# EAGLE design schematic (EAGLE 8.0.0)
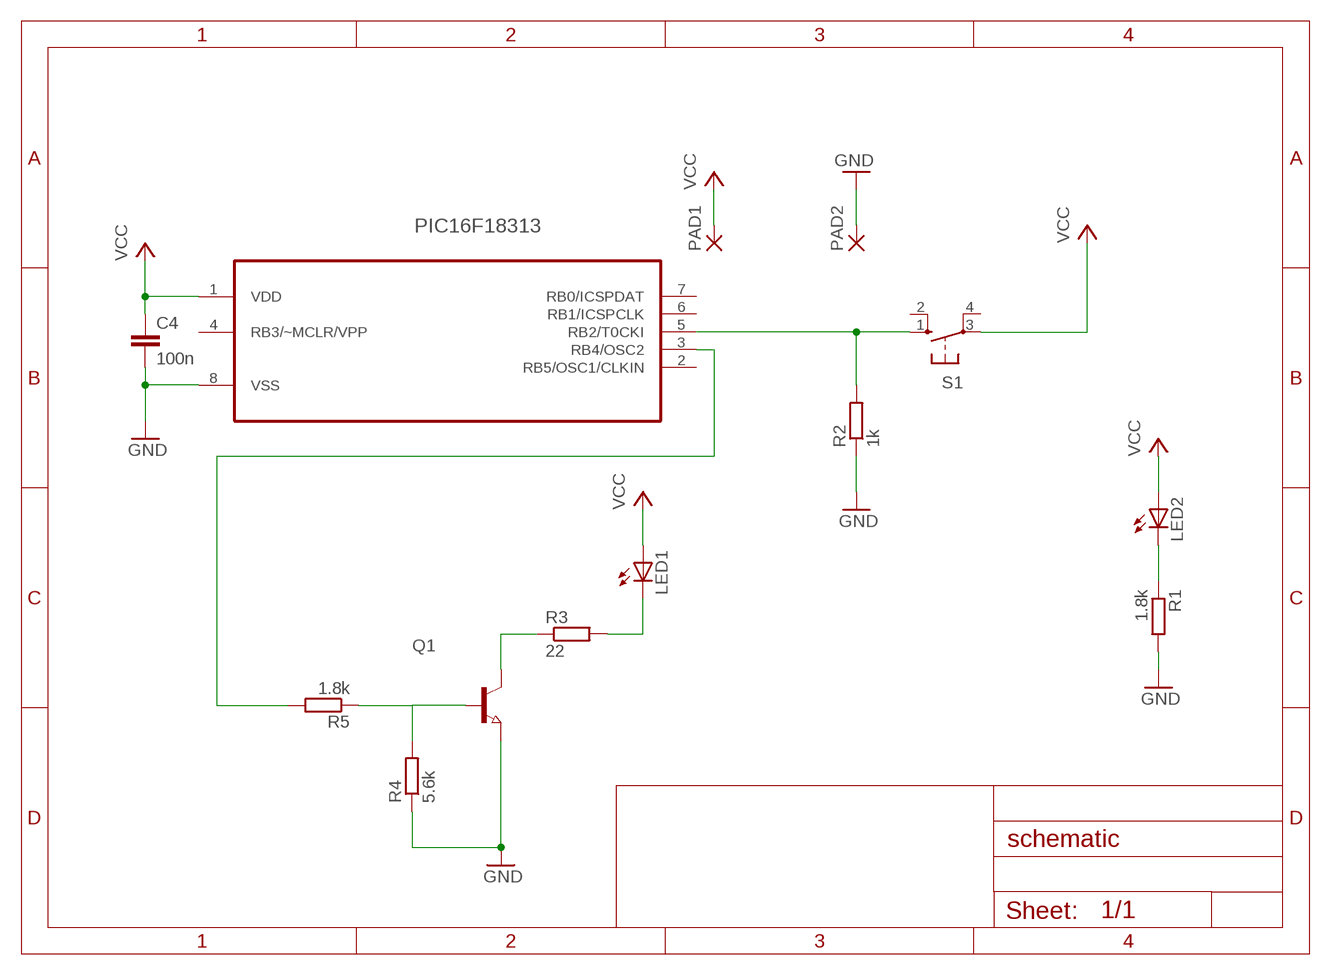
[diagram p0: schematic, sheet 1]

## Parts
C4  100n  C-EUC1206  [C1206]
LED1  LED3MM  [LED3MM]
LED2  LEDCHIPLED_1206  [CHIPLED_1206]
PAD1  2,54/0,9  [2,54/0,9]
PAD2  2,54/0,9  [2,54/0,9]
PIC16F18313  PIC12F519-I/P  [DIP254P762X533-8]
Q1  NPN-TRANSISTOR_SOT23  [SOT23]
R1  1.8k  R-EU_M1206  [M1206]
R2  1k  R-EU_M1206  [M1206]
R3  22  R-EU_M1206  [M1206]
R4  5.6k  R-EU_M1206  [M1206]
R5  1.8k  R-EU_M1206  [M1206]
S1  10-XX  [B3F-10XX]

## Nets
GND: C4.2 PAD2.1(P) PIC16F18313.8(VSS) Q1.2(E) R1.2 R2.1 R4.1
N$1: PIC16F18313.3(RB4/OSC2) R5.2
N$2: PIC16F18313.5(RB2/T0CKI) R2.2 S1.1(S)
N$3: Q1.3(C) R3.1
N$4: LED1.K(C) R3.2
N$5: LED2.C R1.1
N$6: Q1.1(B) R4.2 R5.1
VCC: C4.1 LED1.A LED2.A PAD1.1(P) PIC16F18313.1(VDD) S1.3(P)
Unconnected: PIC16F18313.2(RB5/OSC1/CLKIN) PIC16F18313.4(RB3/~MCLR/VPP) PIC16F18313.6(RB1/ICSPCLK) PIC16F18313.7(RB0/ICSPDAT) S1.2(S1) S1.4(P1)

## Library data of the parts
C4 = resistor:C-EU: CAPACITOR, European symbol
LED1 LED2 = led:LED: LED OSRAM: - CHIPLED LG R971, LG N971, LY N971, LG Q971, LY Q971, LO R971, LY R971 LH N974, LH R974 LS Q976, LO Q976, LY Q976 LO Q996 - Hyper CHIPLED LW Q18S LB Q993, LB Q99A, LB R99A - SideLED LS A670, LO A670, LY A670, LG A670, LP A670 LB A673, LV A673, LT A673, LW A673 LH A674 LY A675 LS A676, LA A676, LO A676, LY A676, LW A676 LS A679, LY A679, LG A679 - Hyper Micro SIDELED® LS Y876, LA Y876, LO Y876, LY Y876 LT Y87S - SmartLED LW L88C, LW L88S LB L89C, LB L89S, LG L890 LS L89K, LO L89K, LY L89K LS L896, LA L896, LO L896, LY L896 - TOPLED LS T670, LO T670, LY T670, LG T670, LP T670 LSG T670, LSP T670, LSY T670, LOP T670, LYG T670 LG T671, LOG T671, LSG T671 LB T673, LV T673, LT T673, LW T673 LH T674 LS T676, LA T676, LO T676, LY T676, LB T676, LH T676, LSB T676, LW T676 LB T67C, LV T67C, LT T67C, LS T67K, LO T67K, LY T67K, LW E67C LS E67B, LA E67B, LO E67B, LY E67B, LB E67C, LV E67C, LT E67C LW T67C LS T679, LY T679, LG T679 LS T770, LO T770, LY T770, LG T770, LP T770 LB T773, LV T773, LT T773, LW T773 LH T774 LS E675, LA E675, LY E675, LS T675 LS T776, LA T776, LO T776, LY T776, LB T776 LHGB T686 LT T68C, LB T68C - Hyper Mini TOPLED® LB M676 - Mini TOPLED Santana® LG M470 LS M47K, LO M47K, LY M47K Source: http://www.osram.convergy.de LUXEON: - LUMILED® LXK2-PW12-R00, LXK2-PW12-S00, LXK2-PW14-U00, LXK2-PW14-V00 LXK2-PM12-R00, LXK2-PM12-S00, LXK2-PM14-U00 LXK2-PE12-Q00, LXK2-PE12-R00, LXK2-PE12-S00, LXK2-PE14-T00, LXK2-PE14-U00 LXK2-PB12-K00, LXK2-PB12-L00, LXK2-PB12-M00, LXK2-PB14-N00, LXK2-PB14-P00, LXK2-PB14-Q00 LXK2-PR12-L00, LXK2-PR12-M00, LXK2-PR14-Q00, LXK2-PR14-R00 LXK2-PD12-Q00, LXK2-PD12-R00, LXK2-PD12-S00 LXK2-PH12-R00, LXK2-PH12-S00 LXK2-PL12-P00, LXK2-PL12-Q00, LXK2-PL12-R00 Source: www.luxeon.com KINGBRIGHT: KA-3528ASYC Source: www.kingbright.com
PAD1 PAD2 = wirepad:2,54/0,9: THROUGH-HOLE PAD
PIC16F18313 = Microchip_By_element14_Batch_1:PIC12F519-I/P: 8-Bit Flash Microcontrollers; MPN: PIC18F18313-I/P; OC_FARNELL: 1548437; OC_NEWARK: 40M1387; PACKAGE: DIP-8; SUPPLIER: Microchip
Q1 = semicon-smd-ipc:NPN-TRANSISTOR_: NPN TRANSISTOR
R1-R5 = resistor:R-EU_: RESISTOR, European symbol
S1 = switch-omron:10-XX: OMRON SWITCH; MPN: B3F-1000; OC_FARNELL: 176432; OC_NEWARK: 36M3542

## Board
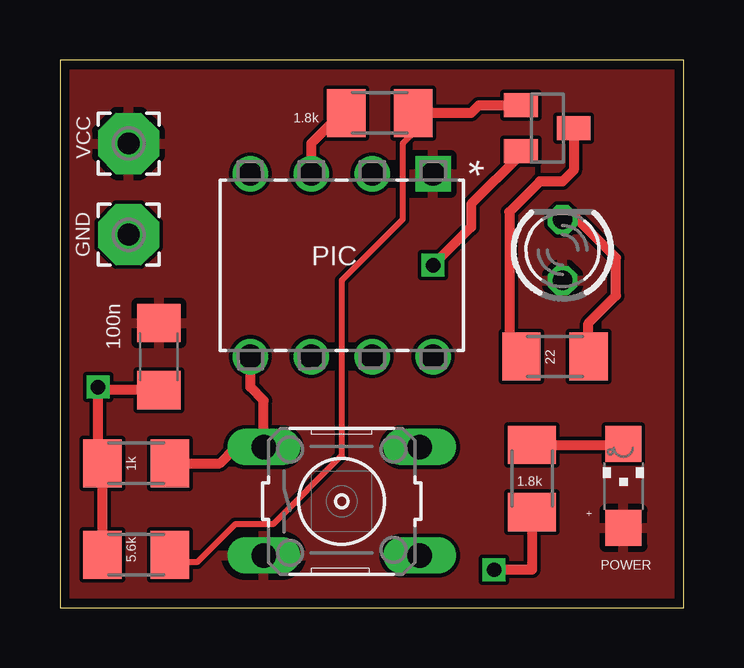
[diagram p1: board, top side]
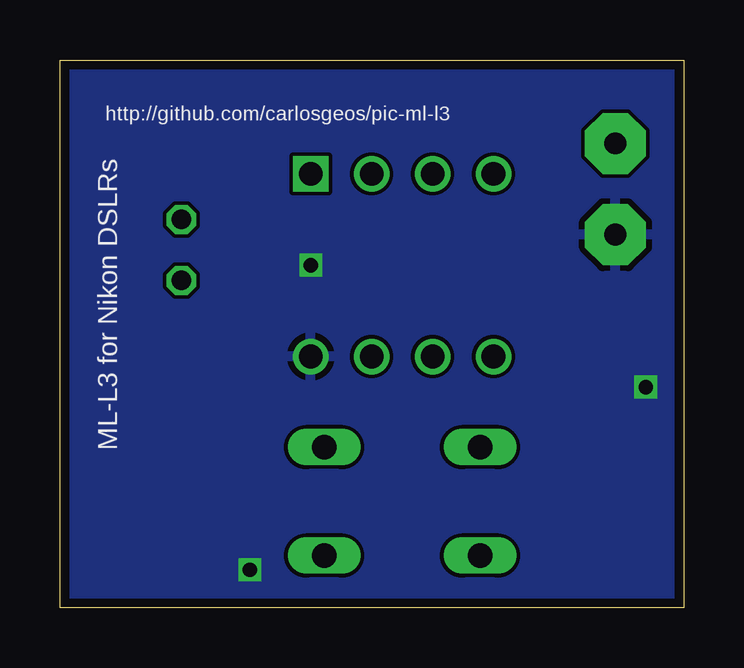
[diagram p2: board, bottom side, seen from below]

Size 26.02 x 22.85 mm. Coordinates in mm from the lower left corner, seen from the top.
Outline: 0,0 26.02,0 26.02,22.85 0,22.85 0,0
Copper layers (1*16): Top 0.0356mm / dielectric 1.5011mm / Bottom 0.0356mm
Design rules "LaenPCBOrder": minimum track width 6mil, minimum drill 13mil, track to track 6mil, track to pad 6mil, pad to pad 6mil, via to via 6mil, smd to smd 6mil, copper to edge 15mil, drill to drill 6mil, minimum pad ring 7mil, minimum via ring 7mil, stop-mask expansion 3mil, vias tented up to drill 0mil, thermal gap 10mil

### Footprints (pad centres in the part's own frame; a part is rotated, then mirrored left to right if it is on the bottom)
C1206 = smd 1.6 x 1.8: 1 -1.4,0; 2 1.4,0
LED3MM = drill 0.813 octagon: A -1.27,0; K 1.27,0
CHIPLED_1206 = smd 1.5 x 1.5: A 0,-1.75; C 0,1.75
2,54/0,9 = drill 0.914 pad 2.54 octagon: 1 0,0
DIP254P762X533-8 = drill 0.991 square: 1 -7.62,7.62 | drill 0.991: 2 -7.62,5.08; 3 -7.62,2.54; 4 -7.62,0; 5 0,0; 6 0,2.54; 7 0,5.08; 8 0,7.62
SOT23 = smd 1 x 1.4: 1 -0.95,-1.1; 2 0.95,-1.1; 3 0,1.1
M1206 = smd 1.6 x 2: 1 -1.4,0; 2 1.4,0
B3F-10XX = drill 1.016 long: 1 -3.251,2.261; 2 3.251,2.261; 3 -3.251,-2.261; 4 3.251,-2.261

### Placement (x,y rotation side)
C4  4.13,10.48 270 top
LED1  20.95,14.92 90 top
LED2  23.5,5.08 0 top
PAD1  2.86,19.37 0 top
PAD2  2.86,15.56 0 top
PIC16F18313  7.94,10.48 270 top
Q1  20.32,20 270 top
R1  19.68,5.4 270 top
R2  3.17,6.03 0 top
R3  20.64,10.48 0 top
R4  3.17,2.22 0 top
R5  13.34,20.64 180 top
S1  11.75,4.45 0 top

### Tracks (layer width: path | path; a pad name or v marks a point on that pad's centre or on a via)
GND  (via drill 0.6)
  Top 0.406: C4.2 1.59,9.08 v1.59,9.21 1.59,6.03 R2.1 R4.1 | R1.2 19.68,1.59 v18.1,1.59 | Q1.2 19.22,18.9 17.14,16.83 17.14,15.88 v15.56,14.29
  pour Bottom: -1.27,29.21 49.53,29.21 49.53,-1.27 -1.27,-1.27 -1.27,1.27
N$1
  Top 0.406: R5.2 11.75,20.64 10.48,19.37 PIC16F18313.3
N$2
  Top 0.406: PIC16F18313.5 7.94,9.21 8.5,8.65 S1.1 8.46,6.67 7.3,6.67 6.67,6.03 R2.2
N$3
  Top 0.406: Q1.3 21.42,18.25 20.95,17.78 20,17.78 18.73,16.51 18.73,10.98 R3.1
N$4
  Top 0.406: R3.2 22.04,11.88 23.18,13.02 23.18,14.61 21.59,16.19 LED1.K
N$5
  Top 0.406: R1.1 23.46,6.8 LED2.C
N$6
  Top 0.254: R5.1 14.73,19.82 14.29,19.37 14.29,16.19 11.75,13.65 11.75,6.35 8.89,3.49 7.3,3.49 5.71,1.91 4.89,1.91 R4.2
  Top 0.406: R5.1 17.14,20.64 17.46,20.95 Q1.1
VCC
  pour Top: 0,29.21 0,0 39.37,0 39.37,29.21

### Text on the board
tNames: VCC | GND | PIC | + | POWER
bNames: http://github.com/carlosgeos/pic-ml-l3 | ML-L3 for Nikon DSLRs